# EAGLE design LIS2DH_16g (EAGLE 7.6.0)
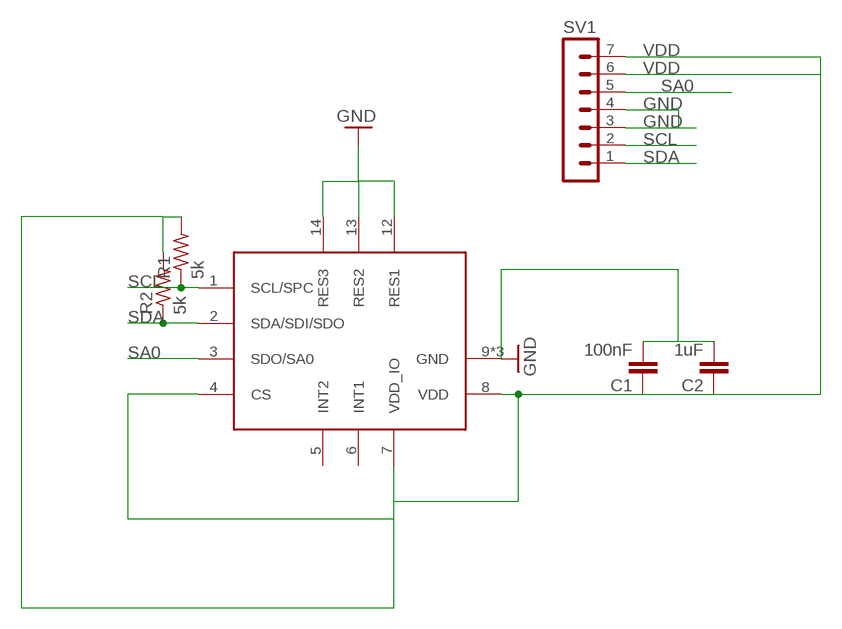
[diagram p0: schematic, sheet 1]

## Parts
C1  100nF  C-EUC0402  [C0402]
C2  1uF  C-EUC0402  [C0402]
R1  5k  R-US_R0402  [R0402]
R2  5k  R-US_R0402  [R0402]
SV1  MA07-1  [MA07-1]
U$1  LISDH_16G  [LGA14_2X2]

## Nets
GND: C1.2 C2.2 SV1.3 SV1.4 U$1.9(GND) U$1.10(GND) U$1.11(GND) U$1.12(RES1) U$1.13(RES2) U$1.14(RES3)
SA0: SV1.5 U$1.3(SDO/SA0)
SCL: R1.1 SV1.2 U$1.1(SCL/SPC)
SDA: R2.1 SV1.1 U$1.2(SDA/SDI/SDO)
VDD: C1.1 C2.1 R1.2 R2.2 SV1.6 SV1.7 U$1.4(CS) U$1.7(VDD_IO) U$1.8(VDD)
Unconnected: U$1.5(INT2) U$1.6(INT1)

## Library data of the parts
C1 C2 = rcl:C-EU: CAPACITOR, European symbol
R1 R2 = rcl:R-US_: RESISTOR, American symbol
SV1 = con-lstb:MA07-1: PIN HEADER; OC_FARNELL: unknown; OC_NEWARK: unknown
U$1 = Charles:LISDH_16G: MEMS Digital Output Motion Sensor -- 3-Axis Accelerometer 2/4/8/16g

## Board
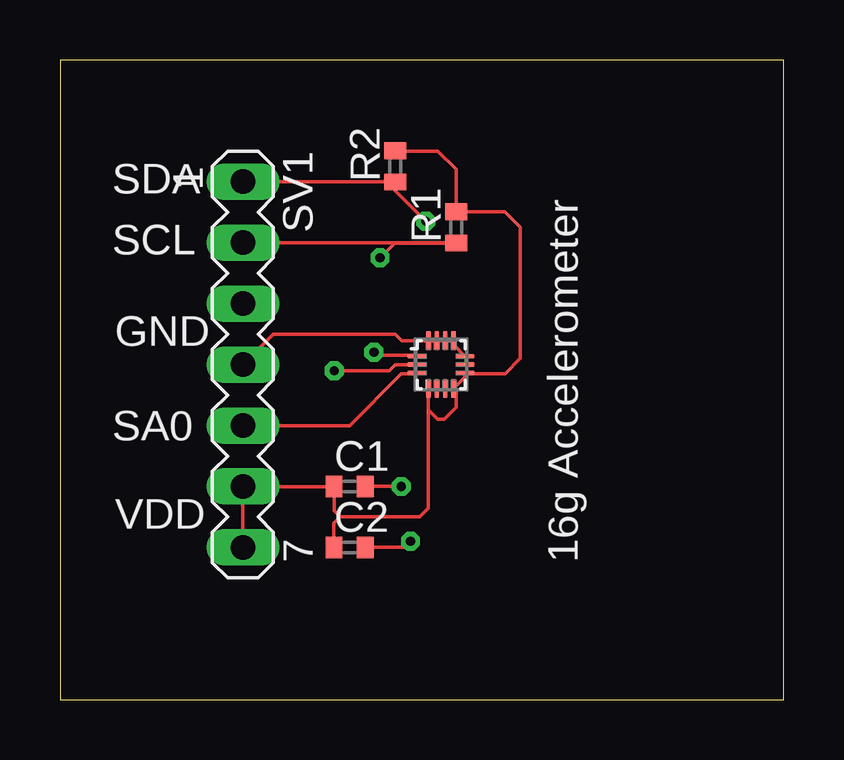
[diagram p1: board, top side]
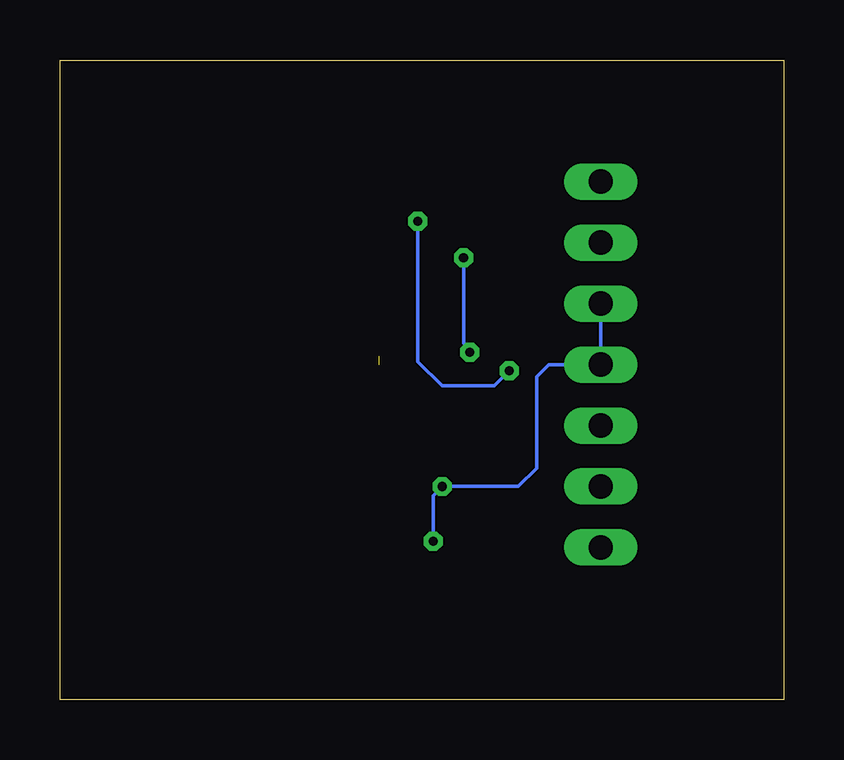
[diagram p2: board, bottom side, seen from below]

Size 30.15 x 26.66 mm. Coordinates in mm from the lower left corner, seen from the top.
Outline: 0,0 30.15,0 30.15,26.66 0,26.66 0,0
Copper layers (1*16): Top 0.035mm / dielectric 1.5mm / Bottom 0.035mm
Design rules "DRC_rules": minimum track width 8mil, minimum drill 15mil, track to track 6mil, track to pad 6mil, pad to pad 6mil, via to via 6mil, smd to smd 6mil, copper to edge 25mil, drill to drill 6mil, minimum pad ring 10mil, minimum via ring 8mil, stop-mask expansion 4mil, vias tented up to drill 0mil, thermal gap 10mil

### Footprints (pad centres in the part's own frame; a part is rotated, then mirrored left to right if it is on the bottom)
C0402 = smd 0.7 x 0.9: 1 -0.65,0; 2 0.65,0
R0402 = smd 0.7 x 0.9: 1 -0.65,0; 2 0.65,0
MA07-1 = drill 1.016 long: 1 -7.62,0; 2 -5.08,0; 3 -2.54,0; 4 0,0; 5 2.54,0; 6 5.08,0; 7 7.62,0
LGA14_2X2 = smd 0.79 x 0.19: 1 -0.995,0.35; 2 -0.995,0; 3 -0.995,-0.35; 8 0.995,-0.35; 9 0.995,0; 10 0.995,0.35 | smd 0.19 x 0.79: 4 -0.525,-0.995; 5 -0.175,-0.995; 6 0.175,-0.995; 7 0.525,-0.995; 11 0.525,0.995; 12 0.175,0.995; 13 -0.175,0.995; 14 -0.525,0.995

### Placement (x,y rotation side)
C1  12.06,8.89 0 top
C2  12.06,6.35 0 top
R1  16.51,19.68 90 top
R2  13.97,22.23 90 top
SV1  7.62,13.97 270 top
U$1  15.88,13.97 0 top

### Tracks (layer width: path | path; a pad name or v marks a point on that pad's centre or on a via)
GND  (via drill 0.38)  (1 unrouted)
  Top 0.152: C2.2 14.35,6.35 v14.61,6.6 | v14.22,8.89 C1.2 | SV1.4 8.89,15.24 13.97,15.24 14.24,14.96 U$1.14 U$1.13 U$1.12 U$1.11 16.4,14.79 U$1.10
  Bottom 0.152: v14.61,6.6 14.61,8.51 v14.22,8.89 11.05,8.89 10.29,9.65 10.29,13.46 9.78,13.97 SV1.4 SV1.3
SA0
  Top 0.152: SV1.5 12.06,11.43 14.22,13.59 14.85,13.59 U$1.3
SCL  (via drill 0.38)
  Top 0.152: SV1.2 16.5,19.05 R1.1 13.96,19.04 v13.34,18.41 | U$1.1 14.85,14.35 13.08,14.35 v13.08,14.48
  Bottom 0.152: v13.34,18.41 13.34,14.86 v13.08,14.48
SDA  (via drill 0.38)
  Top 0.152: SV1.1 13.96,21.59 R2.1 13.97,21.21 v15.24,19.94 | v11.43,13.72 13.72,13.72 13.97,13.97 U$1.2
  Bottom 0.152: v15.24,19.94 15.24,14.1 14.22,13.08 12.06,13.08 v11.43,13.72
VDD
  Top 0.152: 11.68,7.62 14.99,7.62 15.35,7.98 U$1.4 15.35,12.08 15.75,11.68 16,11.68 16.51,12.19 16.51,12.87 U$1.7 16.87,13.45 U$1.8 16.9,13.59 18.54,13.59 19.18,14.22 19.18,19.68 18.53,20.34 R1.2 16.51,22.1 15.75,22.86 13.98,22.86 R2.2 | 11.68,7.62 11.43,7.87 11.43,8.88 | 11.43,8.88 C1.1 | 11.43,8.88 7.63,8.88 SV1.6 SV1.7 | C2.1 11.41,7.35 11.68,7.62

### Text on the board
tPlace: SDA | SCL | GND | SA0 | VDD | 16g Accelerometer